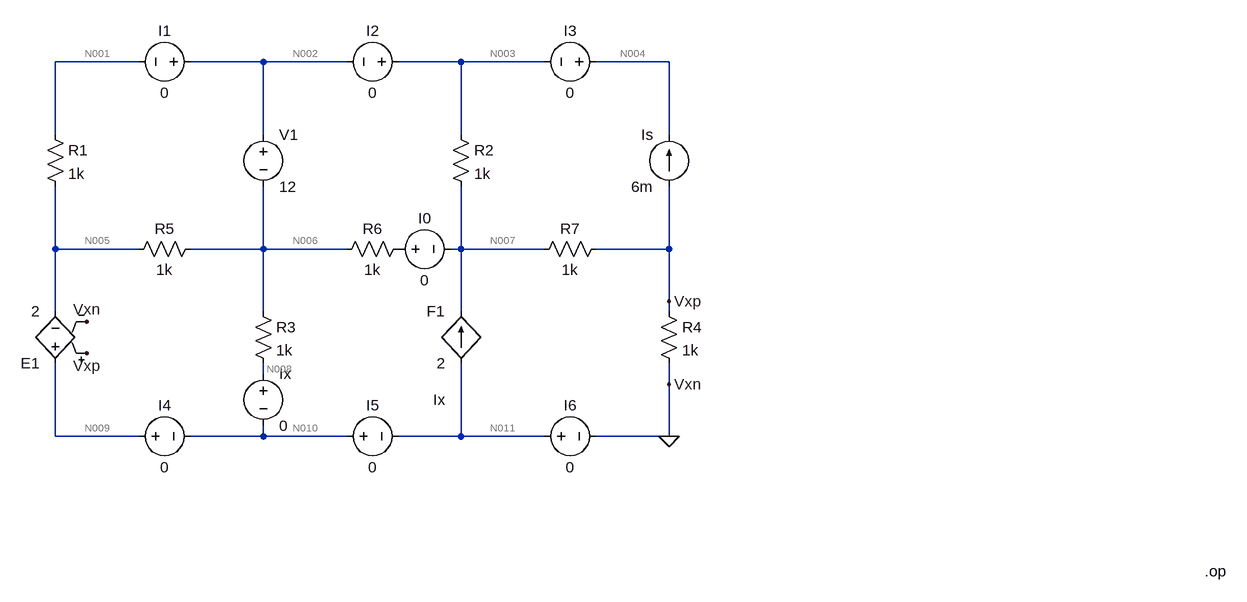
[diagram p0: schematic HW3P04.asc]
HW3P04.asc, the LTspice schematic file:
Version 4
SHEET 1 1936 720
WIRE 256 -80 128 -80
WIRE 448 -80 336 -80
WIRE 576 -80 448 -80
WIRE 752 -80 656 -80
WIRE 880 -80 752 -80
WIRE 1072 -80 960 -80
WIRE 128 32 128 -80
WIRE 448 32 448 -80
WIRE 752 32 752 -80
WIRE 1072 32 1072 -80
WIRE 128 208 128 112
WIRE 256 208 128 208
WIRE 448 208 448 112
WIRE 448 208 336 208
WIRE 576 208 448 208
WIRE 752 208 752 112
WIRE 752 208 736 208
WIRE 880 208 752 208
WIRE 1072 208 1072 112
WIRE 1072 208 960 208
WIRE 1072 288 1072 208
WIRE 128 304 128 208
WIRE 448 304 448 208
WIRE 752 304 752 208
WIRE 1072 304 1072 288
WIRE 448 400 448 384
WIRE 1072 416 1072 384
WIRE 128 496 128 384
WIRE 256 496 128 496
WIRE 448 496 448 480
WIRE 448 496 336 496
WIRE 576 496 448 496
WIRE 752 496 752 384
WIRE 752 496 656 496
WIRE 880 496 752 496
WIRE 1072 496 1072 416
WIRE 1072 496 960 496
FLAG 1072 496 0
FLAG 1072 288 Vxp
FLAG 1072 416 Vxn
FLAG 176 368 Vxp
FLAG 176 320 Vxn
SYMBOL res 112 16 R0
SYMATTR InstName R1
SYMATTR Value 1k
SYMBOL voltage 448 16 R0
SYMATTR InstName V1
SYMATTR Value 12
SYMBOL res 736 16 R0
SYMATTR InstName R2
SYMATTR Value 1k
SYMBOL current 1072 112 R180
WINDOW 0 24 80 Left 2
WINDOW 3 24 0 Left 2
SYMATTR InstName Is
SYMATTR Value 6m
SYMBOL e 128 400 R180
SYMATTR InstName E1
SYMATTR Value 2
SYMBOL res 432 288 R0
SYMATTR InstName R3
SYMATTR Value 1k
SYMBOL res 1056 288 R0
SYMATTR InstName R4
SYMATTR Value 1k
SYMBOL f 752 384 R180
WINDOW 0 24 80 Left 2
WINDOW 3 24 0 Left 2
WINDOW 38 24 -56 Left 2
SYMATTR InstName F1
SYMATTR Value 2
SYMATTR SpiceModel Ix
SYMBOL res 352 192 R90
WINDOW 0 0 56 VBottom 2
WINDOW 3 32 56 VTop 2
SYMATTR InstName R5
SYMATTR Value 1k
SYMBOL res 672 192 R90
WINDOW 0 0 56 VBottom 2
WINDOW 3 32 56 VTop 2
SYMATTR InstName R6
SYMATTR Value 1k
SYMBOL res 976 192 R90
WINDOW 0 0 56 VBottom 2
WINDOW 3 32 56 VTop 2
SYMATTR InstName R7
SYMATTR Value 1k
SYMBOL voltage 448 384 R0
SYMATTR InstName Ix
SYMATTR Value 0
SYMBOL voltage 352 -80 R90
WINDOW 0 -32 56 VBottom 2
WINDOW 3 32 56 VTop 2
SYMATTR InstName I1
SYMATTR Value 0
SYMBOL voltage 672 -80 R90
WINDOW 0 -32 56 VBottom 2
WINDOW 3 32 56 VTop 2
SYMATTR InstName I2
SYMATTR Value 0
SYMBOL voltage 976 -80 R90
WINDOW 0 -32 56 VBottom 2
WINDOW 3 32 56 VTop 2
SYMATTR InstName I3
SYMATTR Value 0
SYMBOL voltage 240 496 R270
WINDOW 0 32 56 VTop 2
WINDOW 3 -32 56 VBottom 2
SYMATTR InstName I4
SYMATTR Value 0
SYMBOL voltage 560 496 R270
WINDOW 0 32 56 VTop 2
WINDOW 3 -32 56 VBottom 2
SYMATTR InstName I5
SYMATTR Value 0
SYMBOL voltage 864 496 R270
WINDOW 0 32 56 VTop 2
WINDOW 3 -32 56 VBottom 2
SYMATTR InstName I6
SYMATTR Value 0
SYMBOL voltage 640 208 R270
WINDOW 0 32 56 VTop 2
WINDOW 3 -32 56 VBottom 2
SYMATTR InstName I0
SYMATTR Value 0
TEXT 1896 704 Left 2 !.op

The netlist it stands for:
* HW3P04.asc
R1 N001 N005 1k
V1 N002 N006 12
R2 N003 N007 1k
Is Vxp N004 6m
E1 N009 N005 Vxp 0 2
R3 N006 N008 1k
R4 Vxp 0 1k
F1 N011 N007 Ix 2
R5 N006 N005 1k
R6 P001 N006 1k
R7 Vxp N007 1k
V§Ix N008 N010 0
V§I1 N002 N001 0
V§I2 N003 N002 0
V§I3 N004 N003 0
V§I4 N009 N010 0
V§I5 N010 N011 0
V§I6 N011 0 0
V§I0 P001 N007 0
.op
.backanno
.end

* Results of the author's LTspice run, read from the files saved beside the schematic
* Operating Point:
*   V(n001) = 10.8 V
*   V(n005) = 4.32 V
*   V(n002) = 10.8 V
*   V(n006) = -1.2 V
*   V(n003) = 10.8 V
*   V(n007) = 1.68 V
*   V(vxp) = -2.16 V
*   V(n004) = 10.8 V
*   V(n009) = 0 V
*   V(n008) = 0 V
*   V(n011) = 0 V
*   V(p001) = 1.68 V
*   V(n010) = 0 V
*   I(F1) = -2.4 mA
*   I(Is) = 6 mA
*   I(R1) = 6.48 mA
*   I(R2) = 9.12 mA
*   I(R3) = -1.2 mA
*   I(R4) = -2.16 mA
*   I(R5) = -5.52 mA
*   I(R6) = 2.88 mA
*   I(R7) = -3.84 mA
*   I(E1) = -960 µA
*   I(V1) = -9.6 mA
*   I(Ix) = -1.2 mA
*   I(I1) = 6.48 mA
*   I(I2) = -3.12 mA
*   I(I3) = 6 mA
*   I(I4) = 960 µA
*   I(I5) = -240 µA
*   I(I6) = 2.16 mA
*   I(I0) = -2.88 mA